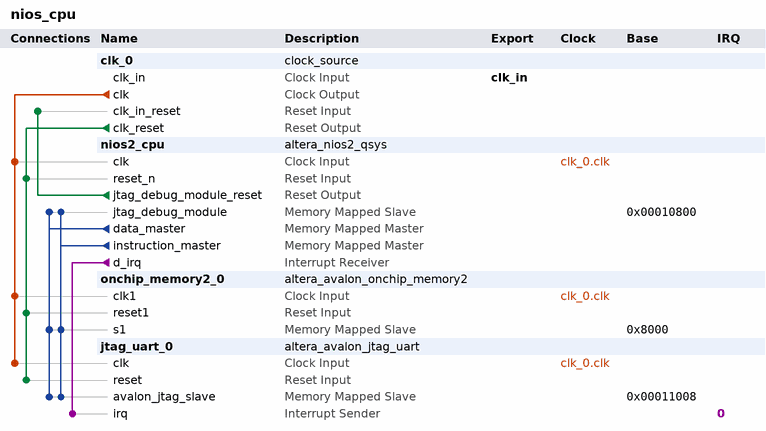
[diagram p0: system contents]
# Platform Designer (Qsys) system nios_cpu, Cyclone II EP2C20F484C7
# Parameters at their usual value, and those the tool derives, are not listed.
package require -exact qsys 13.0
create_system nios_cpu
set_project_property DEVICE_FAMILY {Cyclone II}
set_project_property DEVICE EP2C20F484C7

add_instance clk_0 clock_source 13.0
set_instance_parameter_value clk_0 clockFrequency 50000000

add_instance nios2_cpu altera_nios2_qsys 13.0
set_instance_parameter_value nios2_cpu resetSlave onchip_memory2_0.s1
set_instance_parameter_value nios2_cpu mmu_TLBMissExcSlave None
set_instance_parameter_value nios2_cpu exceptionSlave onchip_memory2_0.s1
set_instance_parameter_value nios2_cpu breakSlave nios2_cpu.jtag_debug_module
set_instance_parameter_value nios2_cpu impl Fast
set_instance_parameter_value nios2_cpu icache_size 4096

add_instance onchip_memory2_0 altera_avalon_onchip_memory2 13.0.1.99.2
set_instance_parameter_value onchip_memory2_0 dataWidth 32
set_instance_parameter_value onchip_memory2_0 dualPort false
set_instance_parameter_value onchip_memory2_0 initMemContent true
set_instance_parameter_value onchip_memory2_0 initializationFileName onchip_mem.hex
set_instance_parameter_value onchip_memory2_0 memorySize 19396

add_instance jtag_uart_0 altera_avalon_jtag_uart 13.0.1.99.2
set_instance_parameter_value jtag_uart_0 simInteractiveOptions NO_INTERACTIVE_WINDOWS

# connections
add_connection clk_0.clk jtag_uart_0.clk clock
add_connection clk_0.clk nios2_cpu.clk clock
add_connection clk_0.clk onchip_memory2_0.clk1 clock
add_connection clk_0.clk_reset jtag_uart_0.reset reset
add_connection clk_0.clk_reset nios2_cpu.reset_n reset
add_connection clk_0.clk_reset onchip_memory2_0.reset1 reset
add_connection nios2_cpu.jtag_debug_module_reset clk_0.clk_in_reset reset
add_connection nios2_cpu.data_master jtag_uart_0.avalon_jtag_slave avalon
set_connection_parameter_value nios2_cpu.data_master/jtag_uart_0.avalon_jtag_slave baseAddress 0x00011008
add_connection nios2_cpu.data_master nios2_cpu.jtag_debug_module avalon
set_connection_parameter_value nios2_cpu.data_master/nios2_cpu.jtag_debug_module baseAddress 0x00010800
add_connection nios2_cpu.data_master onchip_memory2_0.s1 avalon
set_connection_parameter_value nios2_cpu.data_master/onchip_memory2_0.s1 baseAddress 0x8000
add_connection nios2_cpu.instruction_master jtag_uart_0.avalon_jtag_slave avalon
set_connection_parameter_value nios2_cpu.instruction_master/jtag_uart_0.avalon_jtag_slave baseAddress 0x00011008
add_connection nios2_cpu.instruction_master nios2_cpu.jtag_debug_module avalon
set_connection_parameter_value nios2_cpu.instruction_master/nios2_cpu.jtag_debug_module baseAddress 0x00010800
add_connection nios2_cpu.instruction_master onchip_memory2_0.s1 avalon
set_connection_parameter_value nios2_cpu.instruction_master/onchip_memory2_0.s1 baseAddress 0x8000
add_connection nios2_cpu.d_irq jtag_uart_0.irq interrupt
set_connection_parameter_value nios2_cpu.d_irq/jtag_uart_0.irq irqNumber 0

# exported interfaces
add_interface clk_in clock sink
set_interface_property clk_in EXPORT_OF clk_0.clk_in

set_interconnect_requirement {$system} qsys_mm.clockCrossingAdapter HANDSHAKE
set_interconnect_requirement {$system} qsys_mm.maxAdditionalLatency 1

save_system nios_cpu.qsys
